# EAGLE design gps_car_v7 (EAGLE 9.6.2)
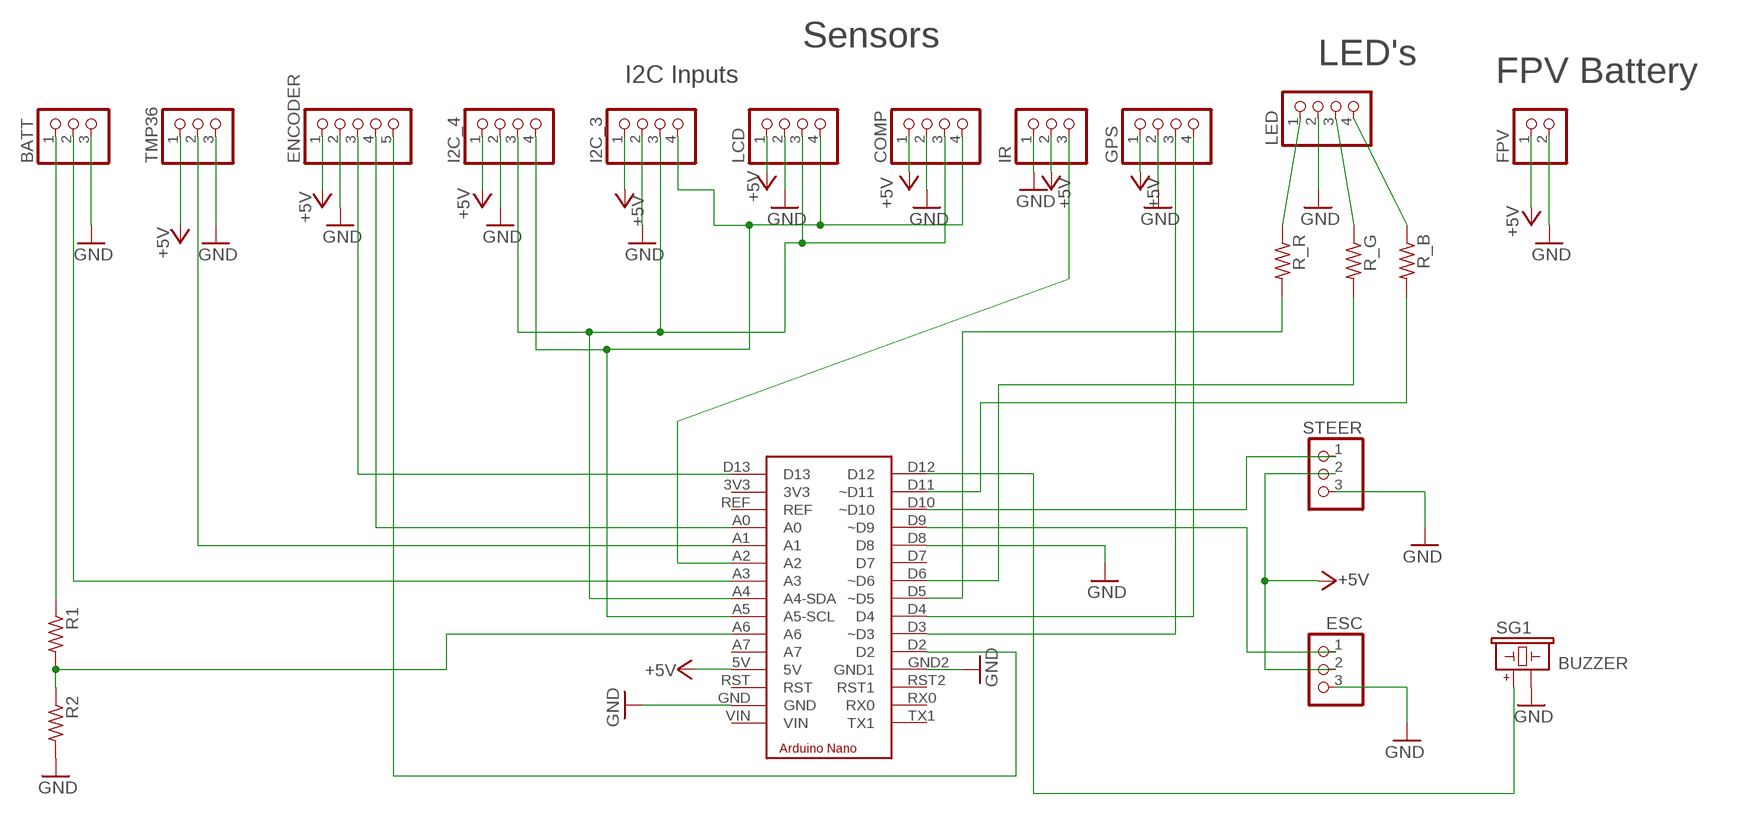
[diagram p0: schematic, sheet 1]

## Parts
BATT  PINHD-1X3  [1X03]
COMP  PINHD-1X4  [1X04]
ENCODER  PINHD-1X5  [1X05]
ESC  PINHD-1X3  [1X03]
FPV  PINHD-1X2  [1X02]
GPS  PINHD-1X4  [1X04]
I2C_3  PINHD-1X4  [1X04]
I2C_4  PINHD-1X4  [1X04]
IR  PINHD-1X3  [1X03]
LCD  PINHD-1X4  [1X04]
LED  PINHD-1X41X04X2MM  [1_04X2MM]
R1  R-US_0204/2V  [0204V]
R2  R-US_0204/2V  [0204V]
R_B  R-US_0204/2V  [0204V]
R_G  R-US_0204/2V  [0204V]
R_R  R-US_0204/2V  [0204V]
SG1  BUZZER  [BUZZER-9MM-PTH]
STEER  PINHD-1X3  [1X03]
TMP36  PINHD-1X31X03/2MM  [1_03X2MM]
U$1  NANO  [NANO]

## Nets
+5V: COMP.1 ENCODER.1 ESC.2 FPV.1 GPS.1 I2C_3.1 I2C_4.1 IR.2 LCD.1 STEER.2 TMP36.1 U$1.5V
BAT_1: BATT.2 U$1.A3
BAT_2: BATT.1 R1.1
GND: BATT.3 COMP.2 ENCODER.2 ESC.3 FPV.2 GPS.2 I2C_3.2 I2C_4.2 IR.1 LCD.2 LED.2 R2.2 SG1.P$2 STEER.3 TMP36.3 U$1.D8 U$1.GND U$1.GND2(GND1)
N$1: ESC.1 U$1.D9(~D9)
N$2: R_B.2 U$1.D11(~D11)
N$3: ENCODER.3 U$1.D13
N$4: GPS.3 U$1.D3(~D3)
N$5: GPS.4 U$1.D4
N$6: ENCODER.5 U$1.D2
N$7: LED.1 R_R.1
N$8: ENCODER.4 U$1.A0
N$10: TMP36.2 U$1.A1
N$11: SG1.P$1 U$1.D12
N$12: LED.3 R_G.1
N$13: LED.4 R_B.1
N$17: R1.2 R2.1 U$1.A6
N$22: R_R.2 U$1.D5(~D5)
N$23: STEER.1 U$1.D10(~D10)
N$24: R_G.2 U$1.D6(~D6)
N$28: IR.3 U$1.A2
SCL: COMP.4 I2C_3.4 I2C_4.4 LCD.4 U$1.A5(A5-SCL)
SDA: COMP.3 I2C_3.3 I2C_4.3 LCD.3 U$1.A4(A4-SDA)
Unconnected: U$1.3V3 U$1.A7 U$1.D7 U$1.REF U$1.RST U$1.RST2(RST1) U$1.RX0 U$1.TX1 U$1.VIN

## Notes on the sheet
- Sensors
- LED's
- I2C Inputs | FPV Battery

## Library data of the parts
BATT TMP36 = pinhead_small:PINHD-1X3: PIN HEADER
COMP GPS I2C_3 I2C_4 LCD = pinhead:PINHD-1X4: PIN HEADER
ENCODER = pinhead_small:PINHD-1X5: PIN HEADER
ESC IR STEER = pinhead:PINHD-1X3: PIN HEADER
FPV = pinhead_small:PINHD-1X2: PIN HEADER
LED = pinhead_small:PINHD-1X4: PIN HEADER
R1 R2 R_B R_G R_R = adafruit:R-US_: RESISTOR, American symbol
SG1 = dhgoldberg:BUZZER: Buzzer
U$1 = BruinRoboticsBlimp:NANO

## Board
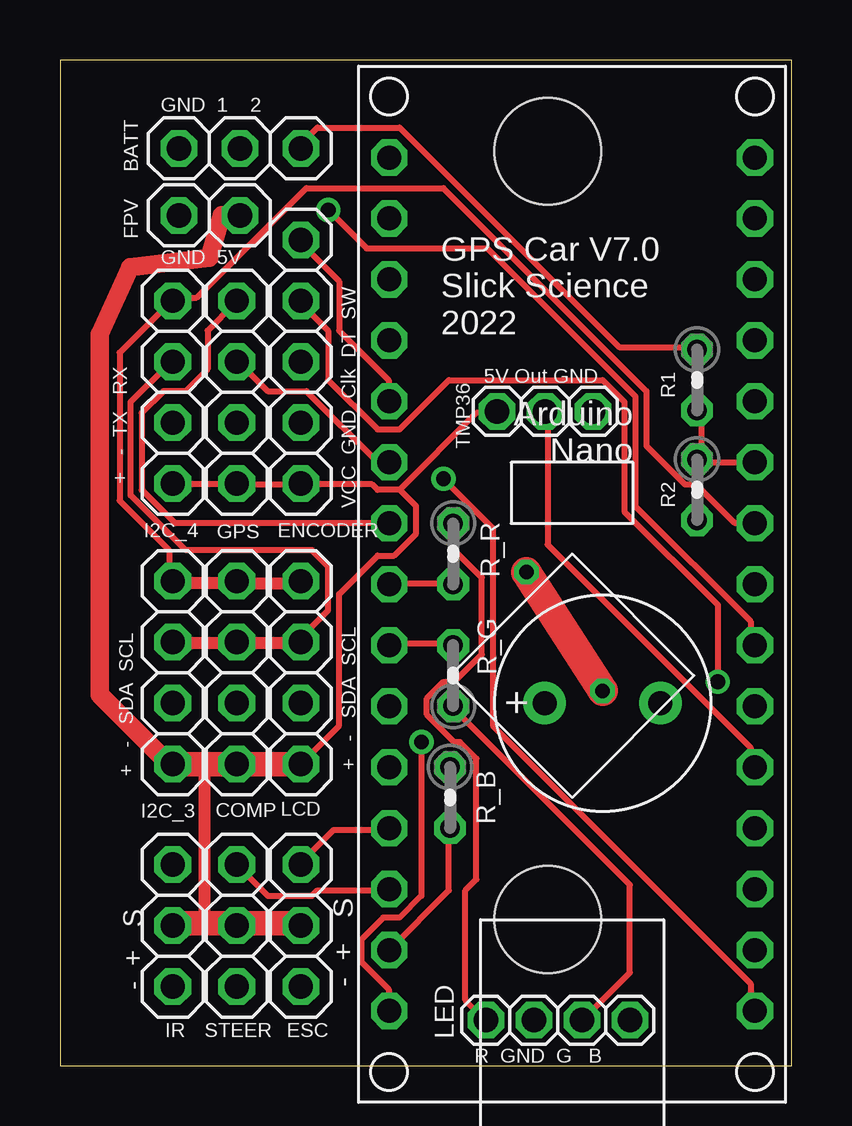
[diagram p1: board, top side]
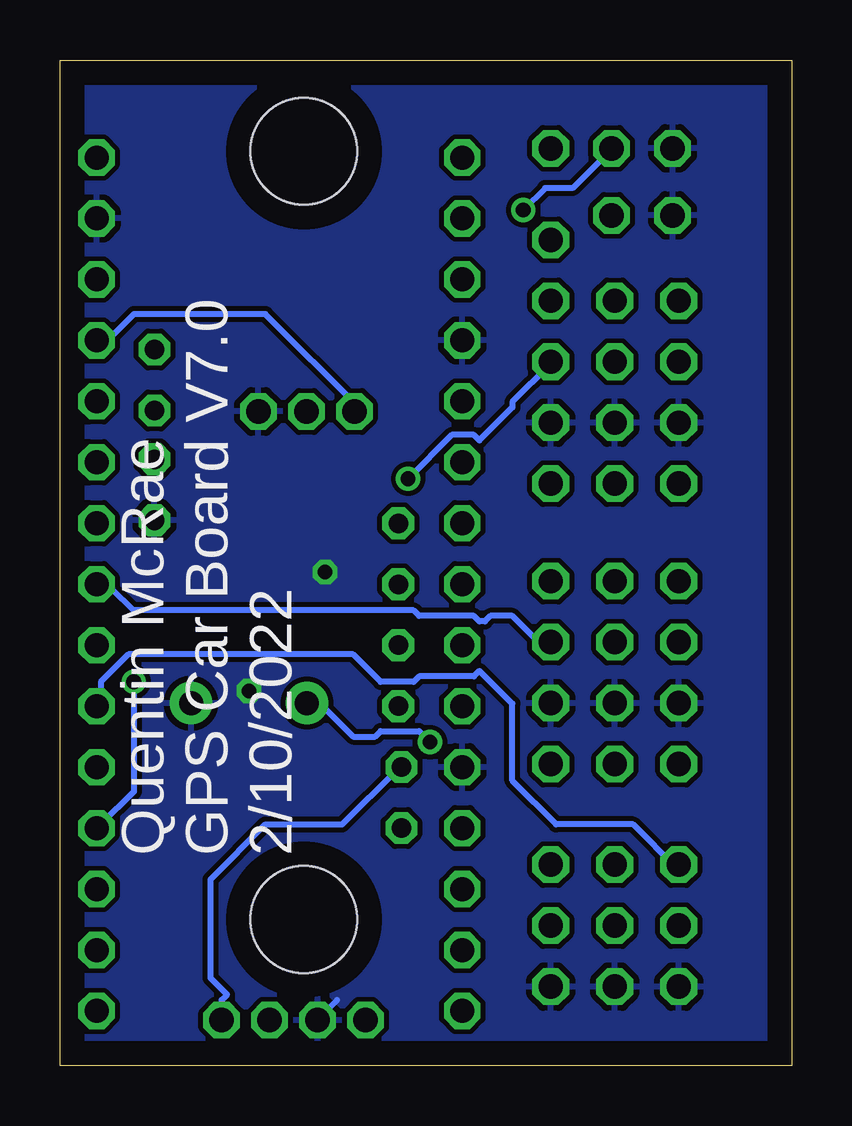
[diagram p2: board, bottom side, seen from below]

Size 30.48 x 41.91 mm. Coordinates in mm from the lower left corner, seen from the top.
Outline: 0,0 30.48,0 30.48,41.91 0,41.91 0,0
Copper layers (1*16): Top 0.035mm / dielectric 1.5mm / Bottom 0.035mm
Design rules "default": minimum track width 10mil, minimum drill 24mil, track to track 8mil, track to pad 8mil, pad to pad 8mil, via to via 8mil, smd to smd 8mil, copper to edge 40mil, drill to drill 8mil, minimum pad ring 10mil, minimum via ring 8mil, stop-mask expansion 4mil, vias tented up to drill 0mil, thermal gap 10mil
Holes 4.45 mm at 20.32,38.1 20.32,6.1

### Footprints (pad centres in the part's own frame; a part is rotated, then mirrored left to right if it is on the bottom)
1X03 = drill 1.016 octagon: 1 -2.54,0; 2 0,0; 3 2.54,0
1X04 = drill 1.016 octagon: 1 -3.81,0; 2 -1.27,0; 3 1.27,0; 4 3.81,0
1X05 = drill 1.016 octagon: 1 -5.08,0; 2 -2.54,0; 3 0,0; 4 2.54,0; 5 5.08,0
1X02 = drill 1.016 octagon: 1 -1.27,0; 2 1.27,0
1_04X2MM = drill 1.016 pad 1.3 octagon: 1 -6,0; 2 -4,0; 3 -2,0; 4 0,0
0204V = drill 0.813 octagon: 1 -1.27,0; 2 1.27,0
BUZZER-9MM-PTH = drill 1 pad 1.778: P$1 -2.413,0; P$2 2.413,0
1_03X2MM = drill 1.016 pad 1.3 octagon: 1 -1.98,-0.04; 2 0.02,-0.04; 3 2.02,-0.04
NANO = drill 1 octagon: 3V3 1.27,36.83; 5V 1.27,11.43; A0 1.27,31.75; A1 1.27,29.21; A2 1.27,26.67; A3 1.27,24.13; A4 1.27,21.59; A5 1.27,19.05; A6 1.27,16.51; A7 1.27,13.97; D2 16.51,13.97; D3 16.51,16.51; D4 16.51,19.05; D5 16.51,21.59; D6 16.51,24.13; D7 16.51,26.67; D8 16.51,29.21; D9 16.51,31.75; D10 16.51,34.29; D11 16.51,36.83; D12 16.51,39.37; D13 1.27,39.37; GND 1.27,6.35; GND2 16.51,11.43; REF 1.27,34.29; RST 1.27,8.89; RST2 16.51,8.89; RX0 16.51,6.35; TX1 16.51,3.81; VIN 1.27,3.81

### Placement (x,y rotation side)
BATT  7.49,38.23 180 top
COMP  7.37,16.38 90 top
ENCODER  10.03,29.34 90 top
ESC  10.03,5.84 270 top
FPV  6.22,35.43 180 top
GPS  7.37,28.07 90 top
I2C_3  4.7,16.38 90 top
I2C_4  4.7,28.07 90 top
IR  4.7,5.84 90 top
LCD  10.03,16.38 90 top
LED  23.75,1.91 0 top
R1  26.54,28.57 270 top
R2  26.54,24 270 top
R_B  16.26,11.18 270 top
R_G  16.38,16.26 90 top
R_R  16.38,21.34 270 top
SG1  22.61,15.11 0 top
STEER  7.37,5.84 270 top
TMP36  20.19,27.3 0 top
U$1  30.23,41.66 180 top

### Tracks (layer width: path | path; a pad name or v marks a point on that pad's centre or on a via)
+5V
  Top 0.254: I2C_4.1 4.78,24.23 7.29,24.23 GPS.1 7.52,24.23 10.03,24.23 | 10.03,24.23 13.01,24.23 13.23,24 14.15,24 | 14.15,24 17.35,27.2 18.03,27.2 TMP36.1 | 10.03,24.23 ENCODER.1 | 4.78,5.94 IR.2 | 7.29,5.94 STEER.2 7.52,5.94 | 10.03,5.94 ESC.2 | 4.55,12.57 I2C_3.1 | 14.15,24 14.83,23.32 14.83,22.17 13.92,21.26 13.23,21.26 11.63,19.66 11.63,14.17 LCD.1
  Top 0.508: 6.02,12.57 6.02,5.94
  Top 0.762: 4.55,12.57 1.65,15.47 1.65,30.48 2.92,33.27 6.23,33.67 6.73,35.43 FPV.1
  Top 1.016: 7.29,5.94 6.02,5.94 4.78,5.94 | 7.52,5.94 10.03,5.94 | I2C_3.1 6.02,12.57 COMP.1 LCD.1
  Bottom 0.254: U$1.5V 28.78,30.4 28.32,30.4 27.41,31.32 21.92,31.32 18.03,27.43 TMP36.1
BAT_1  (via drill 0.61)
  Top 0.254: v11.18,35.66 12.78,34.06 17.8,34.06 23.98,27.89 23.98,23.32 28.78,18.52 28.78,17.6 U$1.A3
  Bottom 0.254: v11.18,35.66 10.26,36.58 9.12,36.58 7.52,38.18 BATT.2
BAT_2
  Top 0.254: R1.1 26.49,29.95 23.29,29.95 14.15,39.09 10.72,39.09 10.03,38.41 BATT.1
GND  (via drill 0.61)
  Top 1.27: v22.61,15.62 v19.43,20.57
  Bottom 0.254: 18.95,2.74 19.63,2.06 LED.2
  pour Bottom: -15.49,46.23 34.54,45.85 34.54,-5.59 -15.49,-5.21
N$1
  Top 0.254: U$1.D9 13.69,9.83 11.4,9.83 10.03,8.46 ESC.1
N$2
  Top 0.254: U$1.D11 16.2,7.32 16.2,9.83 R_B.2
N$3  (via drill 0.61)
  Top 0.254: v15.98,24.46 18.03,22.4 18.03,14.17 28.78,3.43 28.78,2.29 U$1.D13
  Bottom 0.254: v15.98,24.46 14.15,26.29 13.23,26.29 13.01,26.06 11.63,27.43 11.63,27.66 10.03,29.26 ENCODER.3
N$4
  Top 0.254: U$1.D3 13.23,25.15 10.26,28.12 8.66,28.12 7.52,29.26 GPS.3
N$5
  Top 0.254: U$1.D4 13.69,22.63 4.78,22.63 3.4,24 3.4,27.2 4.32,28.12 5.23,28.12 6.15,29.03 6.15,30.63 7.29,31.77 GPS.4
N$6
  Top 0.254: U$1.D2 13.69,27.89 13.69,28.57 11.63,30.63 11.63,32.69 10.03,34.29 ENCODER.5
N$7
  Top 0.254: R_R.1 16.43,22.4 16.43,21.49 17.58,20.34 17.58,17.14 16.43,16 15.98,16 15.29,15.32 15.29,14.63 16.43,13.49 16.66,13.49 17.35,12.8 17.35,7.77 16.89,7.32 16.89,2.74 17.58,2.06 LED.1
N$8  (via drill 0.61)
  Top 0.254: v27.41,16 27.41,19.2 23.52,23.09 23.52,27.66 22.61,28.57 16.2,28.57 14.15,26.52 13.23,26.52 11.18,28.57 11.18,30.63 10.03,31.77 ENCODER.4
  Bottom 0.254: v27.41,16 27.41,11.43 28.78,10.06 U$1.A0
N$10
  Top 0.254: U$1.A1 28.78,12.57 28.78,13.26 20.32,21.72 20.32,27.2 TMP36.2
N$11  (via drill 0.61)
  Top 0.254: v15.06,13.49 15.06,7.09 14.15,6.17 13.46,6.17 12.55,5.26 12.55,4.34 13.69,3.2 13.69,2.29 U$1.D12
  Bottom 0.254: v15.06,13.49 15.52,13.95 17.12,13.95 17.35,13.72 18.26,13.72 19.63,15.09 20.09,15.09 SG1.P$1
N$12
  Top 0.254: R_G.1 16.43,14.86 23.75,7.54 23.75,3.89 21.92,2.06 LED.3
N$13
  Bottom 0.254: LED.4 23.75,2.74 23.52,2.97 24.21,3.66 24.21,7.77 21.92,10.06 18.72,10.06 16.43,12.34 R_B.1
N$17
  Top 0.254: R1.2 26.72,27.2 26.72,25.38 R2.1 26.72,25.15 U$1.A6
N$22
  Top 0.254: R_R.2 16.2,20.12 13.92,20.12 U$1.D5
N$23
  Top 0.254: STEER.1 8.66,7.09 10.49,7.09 10.72,7.32 13.69,7.32 U$1.D10
N$24
  Top 0.254: R_G.2 16.2,17.6 13.92,17.6 U$1.D6
N$28
  Bottom 0.254: U$1.A2 28.78,15.09 28.78,16 27.63,17.14 18.26,17.14 17.12,16 15.75,16 15.52,16.23 13.23,16.23 13.01,16.46 11.63,15.09 11.63,11.89 9.8,10.06 6.6,10.06 4.78,8.23 IR.3
SCL
  Top 0.254: 4.78,20.12 I2C_3.4 4.55,20.34 4.55,21.49 2.49,23.55 2.49,29.72 4.55,31.77 I2C_4.4 4.78,32 5.69,32 10.26,36.58 15.98,36.58 24.44,28.12 24.44,25.83 26.04,24.23 26.49,24.23 28.09,22.63 28.78,22.63 U$1.A5 | 7.29,20.12 COMP.4 7.52,20.12 | 10.03,20.12 LCD.4
  Top 0.508: 7.29,20.12 4.78,20.12 | 7.52,20.12 10.03,20.12
SDA
  Top 0.254: 4.78,17.6 I2C_3.3 | 7.29,17.6 COMP.3 7.52,17.6 | I2C_4.3 4.55,29.26 2.95,27.66 2.95,23.77 5.23,21.49 10.49,21.49 11.18,20.8 11.18,18.97 10.03,17.83 LCD.3 10.03,17.6
  Top 0.508: 7.29,17.6 4.78,17.6 | 10.03,17.6 7.52,17.6
  Bottom 0.254: U$1.A4 28.78,19.89 28.32,19.89 27.41,18.97 15.75,18.97 15.52,18.75 13.23,18.75 13.01,18.52 12.78,18.52 12.55,18.75 11.63,18.75 10.72,17.83 10.03,17.83 LCD.3

### Text on the board
tNames: GND 1 2 | GND 5V | GPS Car V7.0 / Slick Science / 2022 | 5V Out GND | + - TX RX | VCC GND Clk DT SW | + - SDA SCL | + - SDA SCL | - + S | - + S | R GND G B
bNames: Quentin McRae / GPS Car Board V7.0 / 2/10/2022